# EAGLE schematic main (EAGLE 7.6.0)
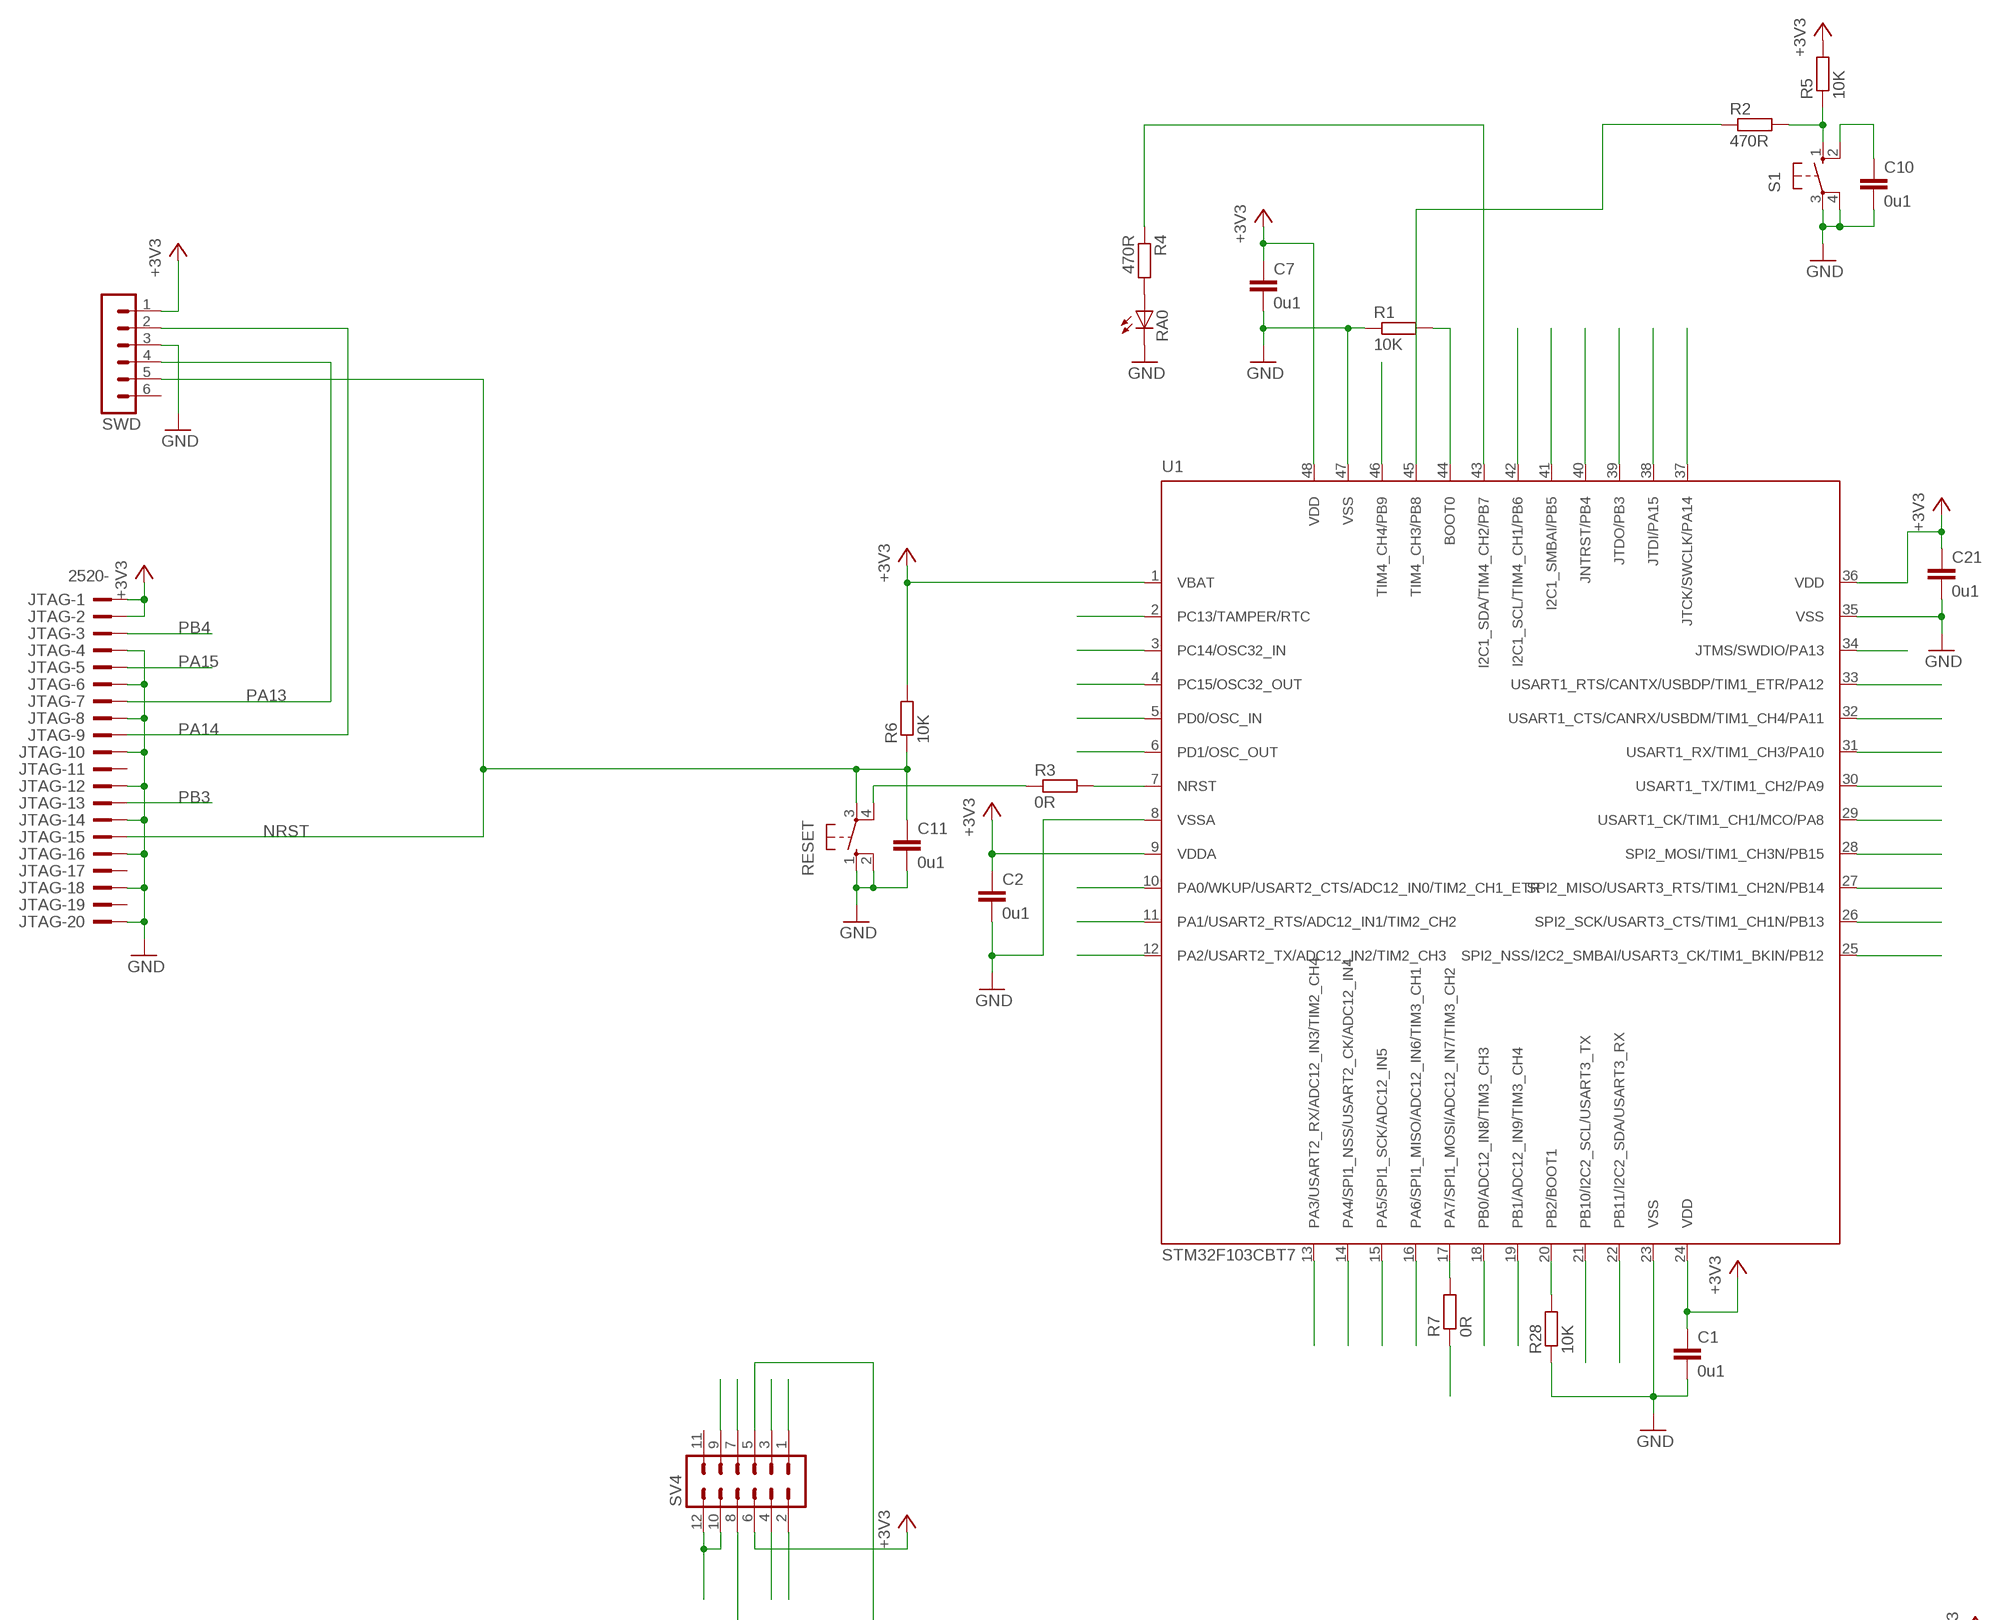
[diagram p0: schematic, sheet 1, part 1 of 2]
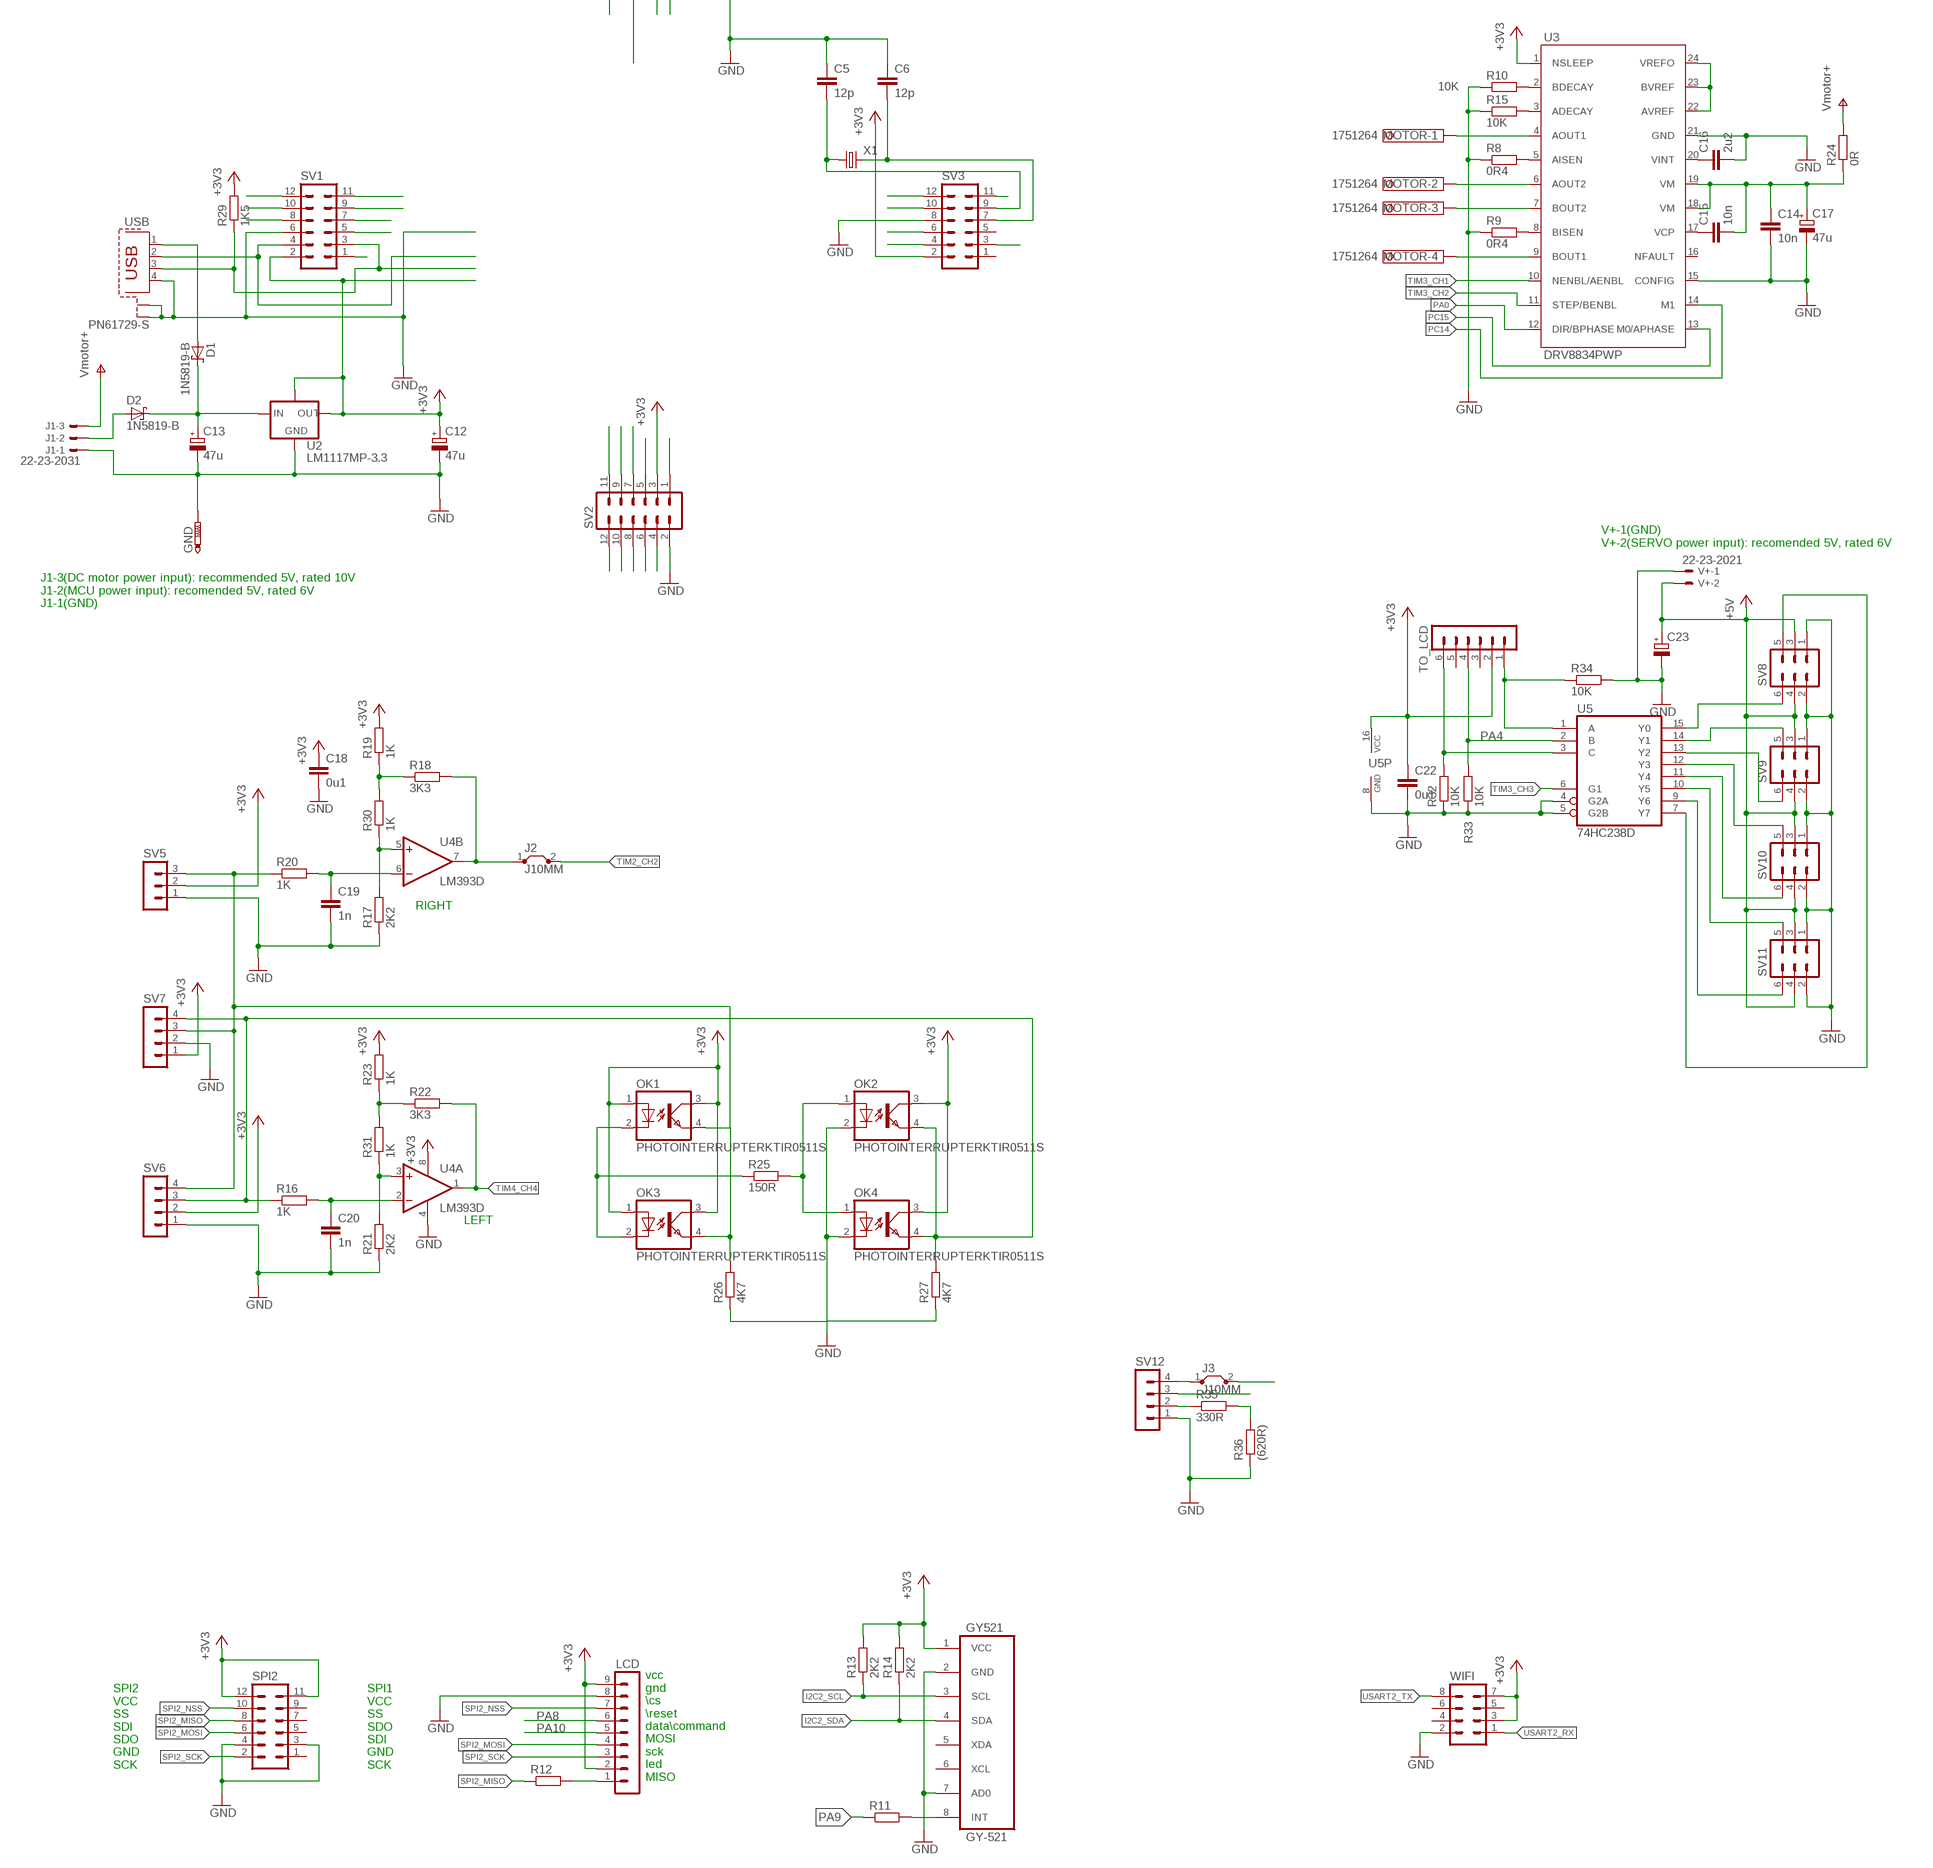
[diagram p1: schematic, sheet 1, part 2 of 2]

## Parts
C1  0u1  C-EUC0805  [C0805]
C2  0u1  C-EUC0805  [C0805]
C5  12p  C-EUC0805  [C0805]
C6  12p  C-EUC0805  [C0805]
C7  0u1  C-EUC0805  [C0805]
C10  0u1  C-EUC0805  [C0805]
C11  0u1  C-EUC0805  [C0805]
C12  47u  CPOL-EUE1.8-4  [E1,8-4]
C13  47u  CPOL-EUE1.8-4  [E1,8-4]
C14  10n  C-EUC0805  [C0805]
C15  10n  C-EUC0805  [C0805]
C16  2u2  C-EUC0805  [C0805]
C17  47u  CPOL-EUE1.8-4  [E1,8-4]
C18  0u1  C-EUC0805  [C0805]
C19  1n  C-EUC0805  [C0805]
C20  1n  C-EUC0805  [C0805]
C21  0u1  C-EUC0805  [C0805]
C22  0u1  C-EUC0805  [C0805]
C23  CPOL-EUE2.5-7  [E2,5-7]
D1  1N5819-B  [DO41-7.6]
D2  1N5819-B  [DO41-7.6]
GND  PTR1PAD1-13  [P1-13]
GY521  GY-521  [GY-521]
J1  22-23-2031  [22-23-2031]
J2  J10MM  [10]
J3  J10MM  [10]
JTAG  2520-  [PAK100/2500-20]
LCD  MA09-1  [MA09-1]
MOTOR  1751264  [1751264]
OK1  PHOTOINTERRUPTERKTIR0511S  [KTIR0511S]
OK2  PHOTOINTERRUPTERKTIR0511S  [KTIR0511S]
OK3  PHOTOINTERRUPTERKTIR0511S  [KTIR0511S]
OK4  PHOTOINTERRUPTERKTIR0511S  [KTIR0511S]
R1  10K  R-EU_M0805  [M0805]
R2  470R  R-EU_0207/10  [0207/10]
R3  0R  R-EU_0207/10  [0207/10]
R4  470R  R-EU_0207/10  [0207/10]
R5  10K  R-EU_0207/10  [0207/10]
R6  10K  R-EU_M0805  [M0805]
R7  0R  R-EU_0207/10  [0207/10]
R8  0R4  R-EU_R2010  [R2010]
R9  0R4  R-EU_R2010  [R2010]
R10  10K  R-EU_R0805  [R0805]
R11  R-EU_0207/10  [0207/10]
R12  R-EU_0207/10  [0207/10]
R13  2K2  R-EU_M0805  [M0805]
R14  2K2  R-EU_M0805  [M0805]
R15  10K  R-EU_R0805  [R0805]
R16  1K  R-EU_0207/10  [0207/10]
R17  2K2  R-EU_M0805  [M0805]
R18  3K3  R-EU_M0805  [M0805]
R19  1K  R-EU_M0805  [M0805]
R20  1K  R-EU_0207/10  [0207/10]
R21  2K2  R-EU_M0805  [M0805]
R22  3K3  R-EU_M0805  [M0805]
R23  1K  R-EU_M0805  [M0805]
R24  0R  R-EU_0207/10  [0207/10]
R25  150R  R-EU_0207/10  [0207/10]
R26  4K7  R-EU_M0805  [M0805]
R27  4K7  R-EU_M0805  [M0805]
R28  10K  R-EU_M0805  [M0805]
R29  1K5  R-EU_M0805  [M0805]
R30  1K  R-EU_M0805  [M0805]
R31  1K  R-EU_M0805  [M0805]
R32  10K  R-EU_M0805  [M0805]
R33  10K  R-EU_M0805  [M0805]
R34  10K  R-EU_M0805  [M0805]
R35  330R  R-EU_M0805  [M0805]
R36  (620R)  R-EU_M0805  [M0805]
RA0  LED3MM  [LED3MM]
RESET  10-XX  [B3F-10XX]
S1  10-XX  [B3F-10XX]
SPI2  MA06-2  [MA06-2]
SV1  MA06-2  [MA06-2]
SV2  MA06-2  [MA06-2]
SV3  MA06-2  [MA06-2]
SV4  MA06-2  [MA06-2]
SV5  MA03-1  [MA03-1]
SV6  MA04-1  [MA04-1]
SV7  MA04-1  [MA04-1]
SV8  MA03-2  [MA03-2]
SV9  MA03-2  [MA03-2]
SV10  MA03-2  [MA03-2]
SV11  MA03-2  [MA03-2]
SV12  MA04-1  [MA04-1]
SWD  MA06-1  [MA06-1]
TO_LCD  MA06-1  [MA06-1]
U1  STM32F103CBT7  [LQFP48-7X7]
U2  LM1117MP-3.3  LM1117  [SOT230P700X180-4N]
U3  DRV8834PWP  [PWP-TSSOP24]
U4  LM393D  [SO08]
U5  74HC238D  [SO16]
USB  PN61729-S  [PN61729-S]
V+  22-23-2021  [22-23-2021]
WIFI  MA04-2  [MA04-2]
X1  CRYSTALHC49S  [HC49/S]

## Nets
+3V3: C1.1 C2.1 C7.1 C12.+ C18.1 C21.1 C22.1 GY521.1(VCC) JTAG.1 JTAG.2 LCD.2 LCD.9 OK1.1(A) OK1.3(COL) OK2.3(COL) OK3.1(A) OK3.3(COL) OK4.3(COL) R5.2 R6.2 R13.2 R14.2 R19.2 R23.2 R29.2 SPI2.11 SPI2.12 SV1.2 SV2.3 SV3.2 SV4.6 SV5.2 SV6.2 SV7.1 SWD.1 TO_LCD.2 U1.1(VBAT) U1.9(VDDA) U1.24(VDD) U1.36(VDD) U1.48(VDD) U2.2(OUT) U2.4(TAB) U3.1(NSLEEP) U4.8(P:V+) U5.16(VCC) WIFI.3 WIFI.7
+5V: C23.+ SV8.3 SV8.4 SV9.3 SV9.4 SV10.3 SV10.4 SV11.3 SV11.4 V+.2
BOOT0: R1.2 SV2.5 U1.44(BOOT0)
BOOT1: R28.2 SV4.8 U1.20(PB2/BOOT1)
GND: C1.2 C2.2 C5.1 C6.1 C7.2 C10.2 C11.2 C12.- C13.- C14.2 C16.2 C17.- C18.2 C19.2 C20.2 C21.2 C22.2 C23.- GND.TP GY521.2(GND) GY521.7(AD0) J1.1 JTAG.4 JTAG.6 JTAG.8 JTAG.10 JTAG.12 JTAG.14 JTAG.16 JTAG.18 JTAG.20 LCD.8 OK2.2(C) OK4.2(C) R1.1 R8.1 R9.1 R10.1 R15.1 R17.1 R21.1 R26.1 R27.1 R28.1 R32.1 R33.1 R34.2 R36.1 RA0.K(C) RESET.1(S) RESET.2(S1) S1.3(P) S1.4(P1) SPI2.3 SPI2.4 SV1.6 SV2.2 SV3.8 SV4.5 SV5.1 SV6.1 SV7.2 SV8.1 SV8.2 SV9.1 SV9.2 SV10.1 SV10.2 SV11.1 SV11.2 SV12.1 SWD.3 U1.8(VSSA) U1.23(VSS) U1.35(VSS) U1.47(VSS) U2.1(GND) U3.15(CONFIG) U3.21(GND) U4.4(P:V-) U5.4(G2A) U5.5(G2B) U5.8(GND) USB.4 USB.S1 USB.S2 V+.1 WIFI.2
I2C2_SCL: GY521.3(SCL) R13.1 SV4.9 U1.21(PB10/I2C2_SCL/USART3_TX)
I2C2_SDA: GY521.4(SDA) R14.1 SV4.10 SV4.12 U1.22(PB11/I2C2_SDA/USART3_RX)
N$1: OK1.4(EMIT) OK3.4(EMIT) R20.1 R26.2 SV5.3 SV6.4 SV7.3
N$2: D1.A USB.1
N$3: J3.1 SV12.4
N$4: GY521.8(INT) R11.2
N$5: R3.2 U1.7(NRST)
N$6: OK1.2(C) OK3.2(C) R25.1
N$7: R18.1 R19.1 R30.2
N$8: R22.1 R23.1 R31.2
N$9: LCD.1 R12.2
N$10: OK2.1(A) OK4.1(A) R25.2
N$11: R3.1 RESET.4(P1)
N$12: OK2.4(EMIT) OK4.4(EMIT) R16.1 R27.2 SV6.3 SV7.4
N$13: D2.A J1.2 J3.2
N$14: SV8.6 U5.15(Y0)
N$16: SV9.5 U5.14(Y1)
N$17: SV9.6 U5.13(Y2)
N$18: SV10.5 U5.12(Y3)
N$19: SV10.6 U5.11(Y4)
N$20: C19.1 R20.2 U4.6(B:-IN)
N$21: R2.2 R5.1 S1.1(S)
N$22: C10.1 S1.2(S1)
N$23: SV11.5 U5.10(Y5)
N$24: SV11.6 U5.9(Y6)
N$25: SV8.5 U5.7(Y7)
N$27: C13.+ D1.C D2.C U2.3(IN)
N$31: R4.2 RA0.A
N$32: R7.2 U1.17(PA7/SPI1_MOSI/ADC12_IN7/TIM3_CH2)
N$33: R35.1 SV12.2
N$37: R8.2 U3.5(AISEN)
N$42: R9.2 U3.8(BISEN)
N$43: R10.2 U3.2(BDECAY)
N$46: R15.2 U3.3(ADECAY)
N$47: U3.22(AVREF) U3.23(BVREF) U3.24(VREFO)
N$48: C15.1 U3.17(VCP)
N$49: C16.1 U3.20(VINT)
N$51: R17.2 R30.1 U4.5(B:+IN)
N$52: C20.1 R16.2 U4.2(A:-IN)
N$53: R21.2 R31.1 U4.3(A:+IN)
N$54: C14.1 C15.2 C17.+ R24.1 U3.18(VM) U3.19(VM)
NRST: C11.1 JTAG.15 R6.1 RESET.3(P) SWD.5
PA0: SV3.10 U1.10(PA0/WKUP/USART2_CTS/ADC12_IN0/TIM2_CH1_ETR) U3.12(DIR/BPHASE)
PA4: R33.2 SV4.1 TO_LCD.4 U1.14(PA4/SPI1_NSS/USART2_CK/ADC12_IN4) U5.2(B)
PA5: SV4.2 U1.15(PA5/SPI1_SCK/ADC12_IN5)
PA8: LCD.6 SV1.7 U1.29(USART1_CK/TIM1_CH1/MCO/PA8)
PA9: R11.1 SV1.8 U1.30(USART1_TX/TIM1_CH2/PA9)
PA10: LCD.5 SV1.5 U1.31(USART1_RX/TIM1_CH3/PA10)
PA13: JTAG.7 SV1.1 SWD.4 U1.34(JTMS/SWDIO/PA13)
PA14: JTAG.9 SV2.12 SWD.2 U1.37(JTCK/SWCLK/PA14)
PA15: JTAG.5 SV2.11 U1.38(JTDI/PA15)
PB1: SV4.7 U1.19(PB1/ADC12_IN9/TIM3_CH4)
PB3: JTAG.13 SV2.10 U1.39(JTDO/PB3)
PB4: JTAG.3 R35.2 R36.2 SV2.9 U1.40(JNTRST/PB4)
PB5: SV2.8 SV12.3 U1.41(I2C1_SMBAI/PB5)
PB6: SV2.7 U1.42(I2C1_SCL/TIM4_CH1/PB6)
PB7: R4.1 SV2.6 U1.43(I2C1_SDA/TIM4_CH2/PB7)
PB8: R2.1 SV2.4 U1.45(TIM4_CH3/PB8)
PC13: SV3.4 U1.2(PC13/TAMPER/RTC)
PC14: SV3.3 U1.3(PC14/OSC32_IN) U3.14(M1)
PC15: SV3.6 U1.4(PC15/OSC32_OUT) U3.13(M0/APHASE)
PD0: C6.2 SV3.7 U1.5(PD0/OSC_IN) X1.2
PD1: C5.2 SV3.9 U1.6(PD1/OSC_OUT) X1.1
SPI2_MISO: R12.1 SPI2.8 SV1.9 U1.27(SPI2_MISO/USART3_RTS/TIM1_CH2N/PB14)
SPI2_MOSI: LCD.4 SPI2.6 SV1.10 U1.28(SPI2_MOSI/TIM1_CH3N/PB15)
SPI2_NSS: LCD.7 SPI2.10 SV1.11 U1.25(SPI2_NSS/I2C2_SMBAI/USART3_CK/TIM1_BKIN/PB12)
SPI2_SCK: LCD.3 SPI2.2 SV1.12 U1.26(SPI2_SCK/USART3_CTS/TIM1_CH1N/PB13)
TIM2_CH2: J2.2 SV3.12 U1.11(PA1/USART2_RTS/ADC12_IN1/TIM2_CH2)
TIM2_CH2A: J2.1 R18.2 U4.7(B:OUT)
TIM3_CH1: SV4.3 U1.16(PA6/SPI1_MISO/ADC12_IN6/TIM3_CH1) U3.10(NENBL/AENBL)
TIM3_CH2: R7.1 SV3.11 U3.11(STEP/BENBL)
TIM3_CH3: SV4.4 U1.18(PB0/ADC12_IN8/TIM3_CH3) U5.6(G1)
TIM4_CH4: R22.2 SV2.1 U1.46(TIM4_CH4/PB9) U4.1(A:OUT)
U5A: R34.1 TO_LCD.1 U5.1(A)
U5C: R32.2 TO_LCD.6 U5.3(C)
USART2_RX: U1.13(PA3/USART2_RX/ADC12_IN3/TIM2_CH4) WIFI.1
USART2_TX: U1.12(PA2/USART2_TX/ADC12_IN2/TIM2_CH3) WIFI.8
USBDM: SV1.4 U1.32(USART1_CTS/CANRX/USBDM/TIM1_CH4/PA11) USB.2
USBDP: R29.1 SV1.3 U1.33(USART1_RTS/CANTX/USBDP/TIM1_ETR/PA12) USB.3
V+: J1.3 R24.2 ; supply symbol labelled Vmotor+
X21: MOTOR.4 U3.9(BOUT1)
X22: MOTOR.3 U3.7(BOUT2)
X23: MOTOR.2 U3.6(AOUT2)
X24: MOTOR.1 U3.4(AOUT1)
Unconnected: GY521.5(XDA) GY521.6(XCL) JTAG.11 JTAG.17 JTAG.19 SPI2.1 SPI2.5 SPI2.7 SPI2.9 SV3.1 SV3.5 SV4.11 SWD.6 TO_LCD.3 TO_LCD.5 U3.16(NFAULT) WIFI.4 WIFI.5 WIFI.6

## Notes on the sheet
- V+-1(GND)
  V+-2(SERVO power input): recomended 5V, rated 6V
- J1-3(DC motor power input): recommended 5V, rated 10V
  J1-2(MCU power input): recomended 5V, rated 6V
  J1-1(GND)
- RIGHT
- LEFT
- SPI2
  VCC
  SS
  SDI
  SDO
  GND
  SCK
- SPI1
  VCC
  SS
  SDO
  SDI
  GND
  SCK
- vcc
  gnd
  \cs
  \reset
  data\command
  MOSI
  sck
  led
  MISO

## Power pins joined to a net without a drawn wire
GND: U3.EXP(GND)

## Library data of the parts
C1 C2 C5-C7 C10 C11 C14-C16 C18-C22 = rcl:C-EU: CAPACITOR, European symbol
C12 C13 C17 C23 = rcl:CPOL-EU: POLARIZED CAPACITOR, European symbol
D1 D2 = diode:1N581*: 1.0A SCHOTTKY BARRIER RECTIFIER Source: http://www.diodes.com/datasheets/ds23001.pdf
GND = testpad:PTR1: TEST PIN
GY521 = ensylam:GY-521: MPU6050, accelerometer and gyroscope
J1 = con-molex:22-23-2031: .100" (2.54mm) Center Header - 3 Pin; MF: MOLEX; MPN: 22-23-2031; OC_FARNELL: 1462950; OC_NEWARK: 30C0862
J2 J3 = jumper:J: Bridge
JTAG = con-3m:2520-: 3M (TM) Pak 100 4-Wall Header Source: 3M; OC_FARNELL: unknown; OC_NEWARK: unknown
LCD = ensylam:MA09-1: PIN HEADER; OC_FARNELL: unknown; OC_NEWARK: unknown
MOTOR = con-phoenix-350:1751264: MKDS 1/ 4-3,5 Printklemme Nennstrom: 10 A Bemessungsspannung: 160 V Raster: 3,5 mm Polzahl: 4 Montageart: Löten Anschlussart: Schraubanschluss Anschlussrichtung vom Leiter zur Platine: 0° Source: http://eshop.phoenixcontact.com .. 1751264.pdf; MPN: 1751264; OC_FARNELL: unknown; OC_NEWARK: 10R0934
OK1-OK4 = ensylam:PHOTOINTERRUPTER: Opto Interrupter
R1-R36 = rcl:R-EU_: RESISTOR, European symbol
RA0 = led:LED: LED OSRAM: - CHIPLED LG R971, LG N971, LY N971, LG Q971, LY Q971, LO R971, LY R971 LH N974, LH R974 LS Q976, LO Q976, LY Q976 LO Q996 - Hyper CHIPLED LW Q18S LB Q993, LB Q99A, LB R99A - SideLED LS A670, LO A670, LY A670, LG A670, LP A670 LB A673, LV A673, LT A673, LW A673 LH A674 LY A675 LS A676, LA A676, LO A676, LY A676, LW A676 LS A679, LY A679, LG A679 - Hyper Micro SIDELED® LS Y876, LA Y876, LO Y876, LY Y876 LT Y87S - SmartLED LW L88C, LW L88S LB L89C, LB L89S, LG L890 LS L89K, LO L89K, LY L89K LS L896, LA L896, LO L896, LY L896 - TOPLED LS T670, LO T670, LY T670, LG T670, LP T670 LSG T670, LSP T670, LSY T670, LOP T670, LYG T670 LG T671, LOG T671, LSG T671 LB T673, LV T673, LT T673, LW T673 LH T674 LS T676, LA T676, LO T676, LY T676, LB T676, LH T676, LSB T676, LW T676 LB T67C, LV T67C, LT T67C, LS T67K, LO T67K, LY T67K, LW E67C LS E67B, LA E67B, LO E67B, LY E67B, LB E67C, LV E67C, LT E67C LW T67C LS T679, LY T679, LG T679 LS T770, LO T770, LY T770, LG T770, LP T770 LB T773, LV T773, LT T773, LW T773 LH T774 LS E675, LA E675, LY E675, LS T675 LS T776, LA T776, LO T776, LY T776, LB T776 LHGB T686 LT T68C, LB T68C - Hyper Mini TOPLED® LB M676 - Mini TOPLED Santana® LG M470 LS M47K, LO M47K, LY M47K Source: http://www.osram.convergy.de LUXEON: - LUMILED® LXK2-PW12-R00, LXK2-PW12-S00, LXK2-PW14-U00, LXK2-PW14-V00 LXK2-PM12-R00, LXK2-PM12-S00, LXK2-PM14-U00 LXK2-PE12-Q00, LXK2-PE12-R00, LXK2-PE12-S00, LXK2-PE14-T00, LXK2-PE14-U00 LXK2-PB12-K00, LXK2-PB12-L00, LXK2-PB12-M00, LXK2-PB14-N00, LXK2-PB14-P00, LXK2-PB14-Q00 LXK2-PR12-L00, LXK2-PR12-M00, LXK2-PR14-Q00, LXK2-PR14-R00 LXK2-PD12-Q00, LXK2-PD12-R00, LXK2-PD12-S00 LXK2-PH12-R00, LXK2-PH12-S00 LXK2-PL12-P00, LXK2-PL12-Q00, LXK2-PL12-R00 Source: www.luxeon.com KINGBRIGHT: KA-3528ASYC Source: www.kingbright.com
RESET S1 = switch-omron:10-XX: OMRON SWITCH; MPN: B3F-1000; OC_FARNELL: 176432; OC_NEWARK: 36M3542
SPI2 SV1-SV4 = con-lstb:MA06-2: PIN HEADER; OC_FARNELL: unknown; OC_NEWARK: unknown
SV5 = con-lstb:MA03-1: PIN HEADER; OC_FARNELL: unknown; OC_NEWARK: unknown
SV6 SV7 SV12 = con-lstb:MA04-1: PIN HEADER; OC_FARNELL: unknown; OC_NEWARK: unknown
SV8-SV11 = con-lstb:MA03-2: PIN HEADER; OC_FARNELL: unknown; OC_NEWARK: unknown
SWD TO_LCD = con-lstb:MA06-1: PIN HEADER; OC_FARNELL: unknown; OC_NEWARK: unknown
U1 = ensylam:STM32F103CBT7: Medium-density performance lin e ARM-based 32-bit MCUwith 64 or 128 KB Flash, USB, CAN, 7 timers, 2 ADCs, 9 com. interfaces Source:http://www.farnell.com/datasheets/1730126.pdf
U2 = ensylam:LM1117: VOLTAGE REGULATOR
U3 = ensylam:DRV8834: DUAL BRIDGE STEPPER OR DC MOTOR DRIVER; ELEMENT14: 2115234
U4 = linear:LM393: COMPARATOR
U5 = ensylam:74*238: 3-line to 8-line DECODER/DEMULTIPLEXER
USB = con-berg:PN61729-S: BERG USB connector; OC_FARNELL: unknown; OC_NEWARK: unknown
V+ = con-molex:22-23-2021: .100" (2.54mm) Center Header - 2 Pin; MF: MOLEX; MPN: 22-23-2021; OC_FARNELL: 1462926; OC_NEWARK: 25C3832
WIFI = con-lstb:MA04-2: PIN HEADER; OC_FARNELL: unknown; OC_NEWARK: unknown
X1 = crystal:CRYSTAL: CRYSTAL; OC_FARNELL: 1667008; OC_NEWARK: unknown